# EAGLE design MultiColorLight (EAGLE 7.3.0)
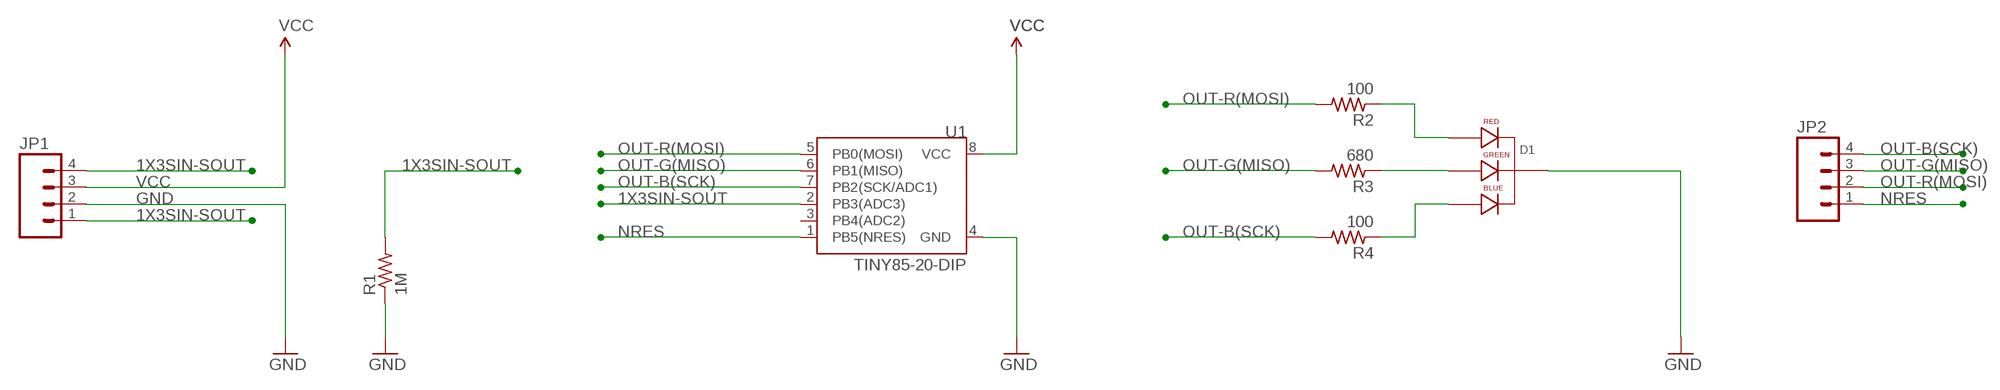
[diagram p0: schematic, sheet 1]

## Parts
D1  LED-RGB-CC-THRUCLEAR  [LED-RGB-THRU]
JP1  M04PTH  [1X04]
JP2  M04PTH  [1X04]
R1  1M  R-US_R0603  [R0603]
R2  100  R-US_R0603  [R0603]
R3  680  R-US_R0603  [R0603]
R4  100  R-US_R0603  [R0603]
U1  TINY85-20-DIP  ATTINY45TINY85-20-DIP  [DIP08]

## Nets
1X3SIN-SOUT: JP1.1 JP1.4 R1.2 U1.2(PB3(ADC3))
GND: D1.2(CATHODE) JP1.2 R1.1 U1.4(GND)
N$1: D1.1(RED_CATHODE) R2.1
N$2: D1.3(GREEN_CATHODE) R3.1
N$3: D1.4(BLUE_CATHODE) R4.1
NRES: JP2.1 U1.1(PB5(NRES))
OUT-B(SCK): JP2.4 R4.2 U1.7(PB2(SCK/ADC1))
OUT-G(MISO): JP2.3 R3.2 U1.6(PB1(MISO))
OUT-R(MOSI): JP2.2 R2.2 U1.5(PB0(MOSI))
VCC: JP1.3 U1.8(VCC)
Unconnected: U1.3(PB4(ADC2))

## Library data of the parts
D1 = SparkFun-LED:LED-RGB-CC-THRU: RGB Through-hole common cathode LED SparkFun Storefront: COM-00105 (Clear) COM-09264 (Diffuse); PROD_ID: DIO-08418
JP1 JP2 = SparkFun-Connectors:M04: Header 4 Standard 4-pin 0.1" header. Use with straight break away headers (SKU : PRT-00116), right angle break away headers (PRT-00553), swiss pins (PRT-00743), machine pins (PRT-00117), and female headers (PRT-00115). Molex polarized connector foot print use with SKU : PRT-08231 with associated crimp pins and housings. 1MM SMD Version SKU: PRT-10208
R1-R4 = adafruit:R-US_: RESISTOR, American symbol
U1 = SparkFun-DigitalIC:ATTINY45: Atmel 8-pin 2/4/8kB flash uC; PROD_ID: IC-09445

## Board
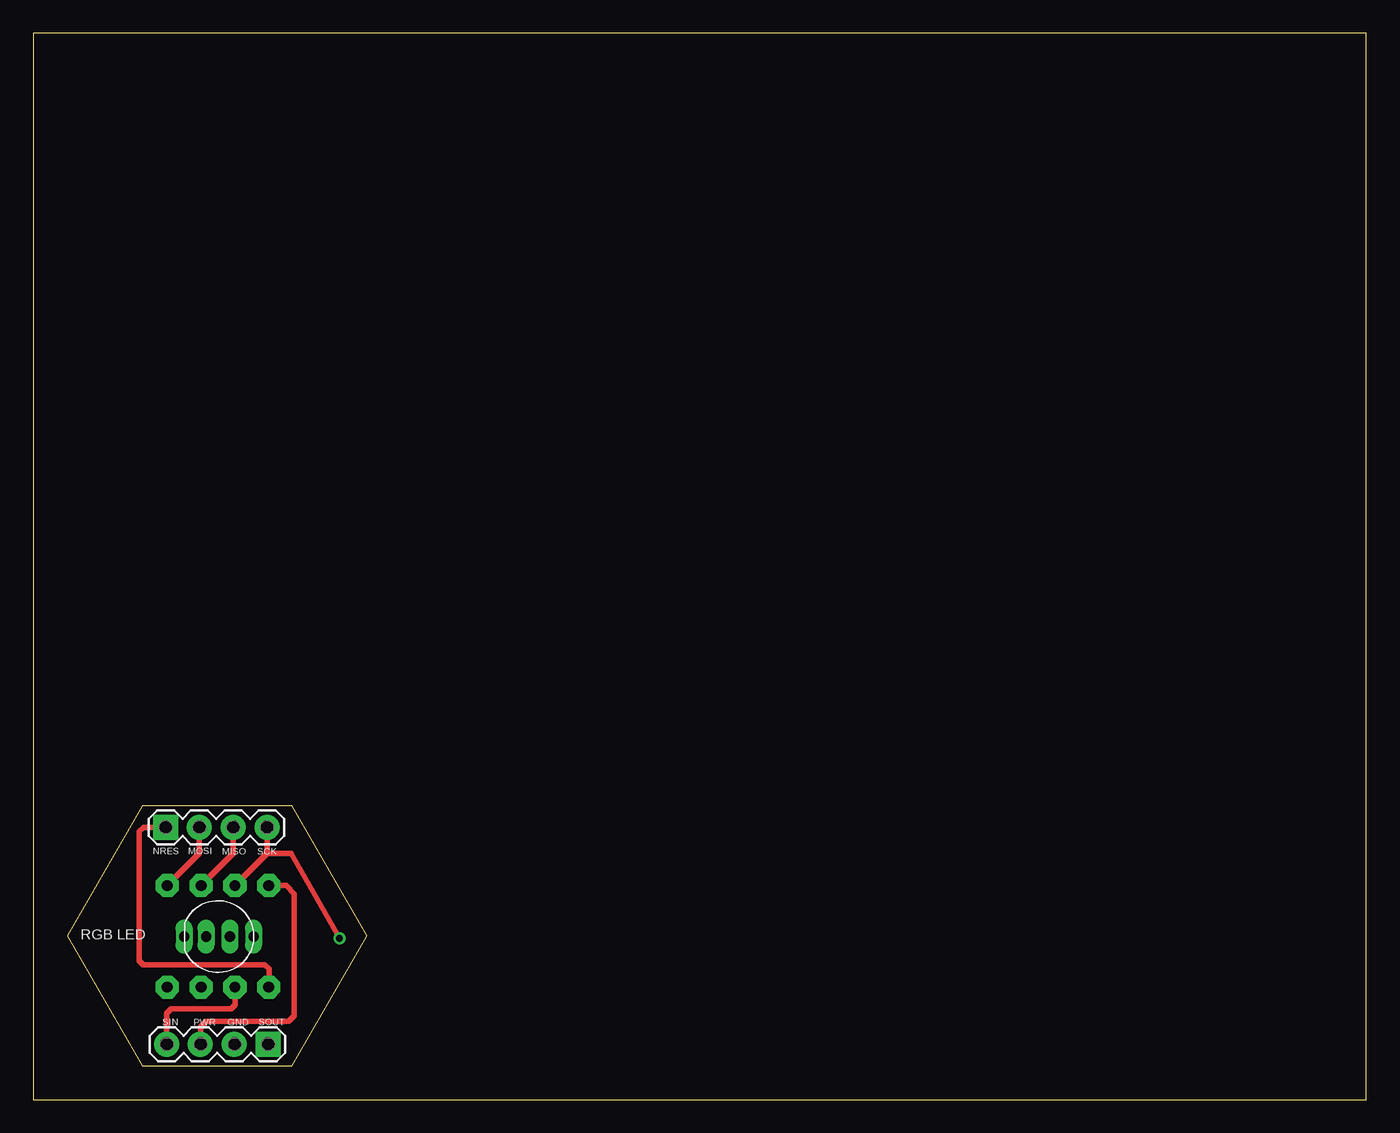
[diagram p1: board, top side]
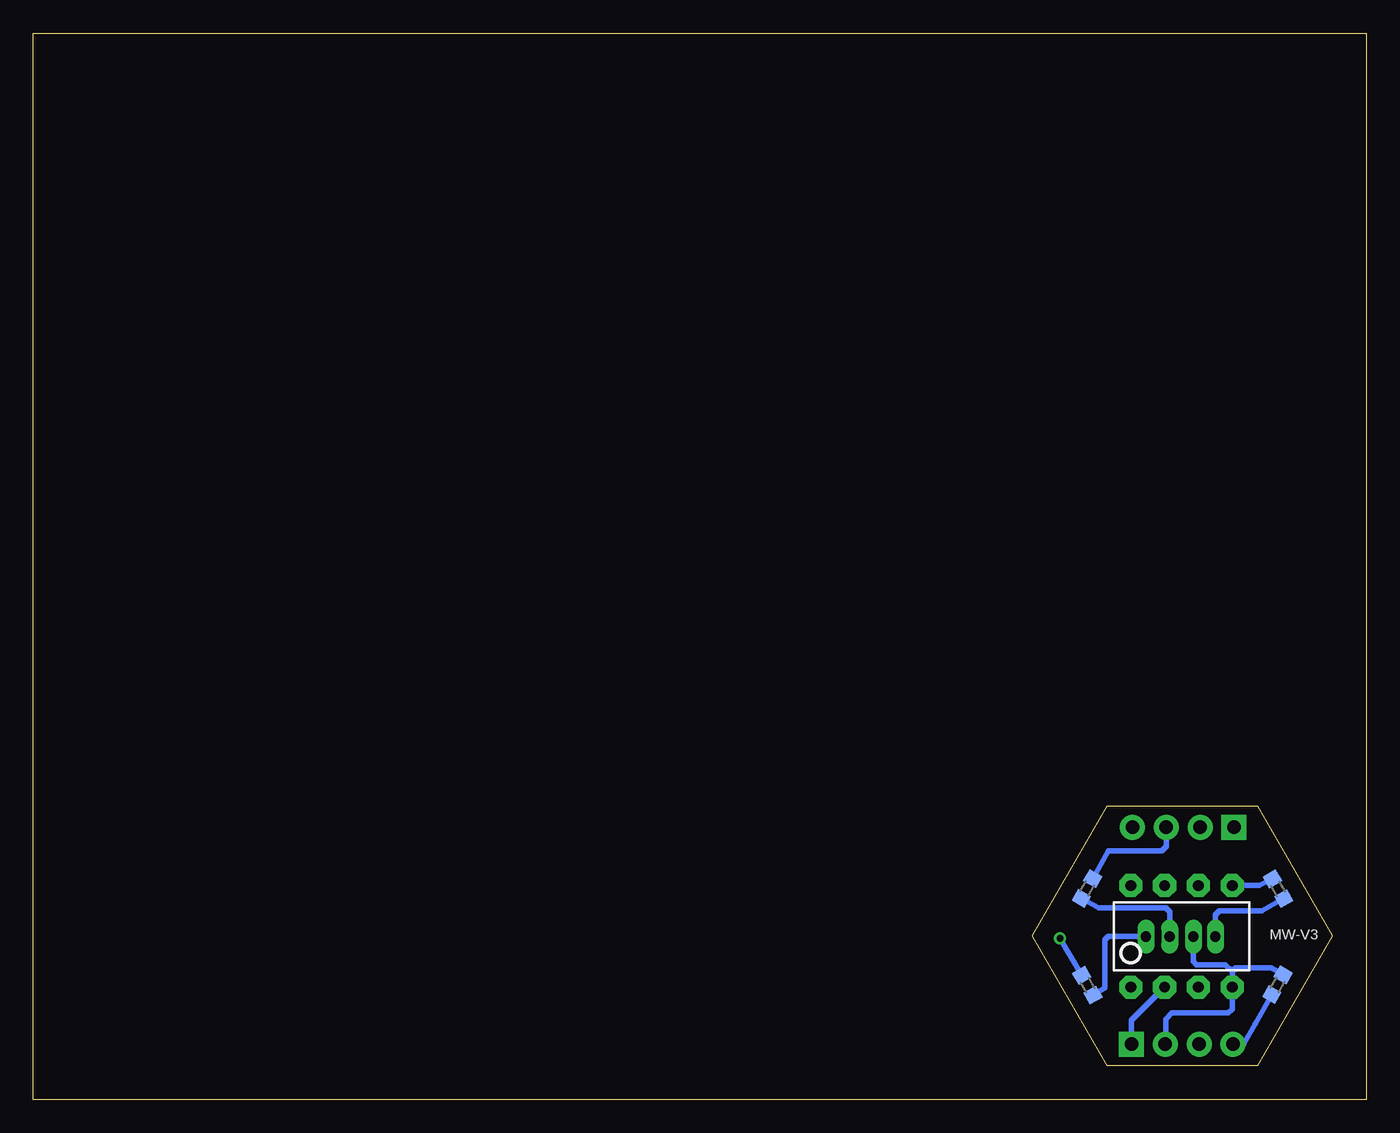
[diagram p2: board, bottom side, seen from below]

Size 100 x 80 mm. Coordinates in mm from the lower left corner, seen from the top.
Outline: 0,0 100,0 100,80 0,80 0,0
Outline: 8.16,2.55 19.41,2.55 25.03,12.29 19.41,22.03 8.16,22.03 2.53,12.29 8.16,2.55
Copper layers (1*16): Top 0.035mm / dielectric 1.5mm / Bottom 0.035mm
Design rules "default *": minimum track width 10mil, minimum drill 24mil, track to track 8mil, track to pad 8mil, pad to pad 8mil, via to via 8mil, smd to smd 8mil, copper to edge 0mil, drill to drill 8mil, minimum pad ring 10mil, minimum via ring 8mil, stop-mask expansion 4mil, vias tented up to drill 0mil, thermal gap 10mil

### Footprints (pad centres in the part's own frame; a part is rotated, then mirrored left to right if it is on the bottom)
LED-RGB-THRU = drill 0.762 pad 0.889 long: 1 2.54,0; 2 0.889,0; 3 -0.889,0; 4 -2.667,0
1X04 = drill 1.016 pad 1.88 square: 1 0,0 | drill 1.016 pad 1.88: 2 2.54,0; 3 5.08,0; 4 7.62,0
R0603 = smd 1 x 1.1: 1 -0.85,0; 2 0.85,0
DIP08 = drill 0.813 pad 1.727 octagon: 1 -3.81,-3.81; 2 -1.27,-3.81; 3 1.27,-3.81; 4 3.81,-3.81; 5 3.81,3.81; 6 1.27,3.81; 7 -1.27,3.81; 8 -3.81,3.81

### Placement (x,y rotation side)
D1  13.86,12.23 180 top
JP1  17.61,4.15 180 top
JP2  9.92,20.42 0 top
R1  6.65,8.61 240 bottom
R2  6.6,15.81 120 bottom
R3  20.94,15.84 60 bottom
R4  20.92,8.57 120 bottom
U1  13.86,12.24 0 bottom

### Tracks (layer width: path | path; a pad name or v marks a point on that pad's centre or on a via)
1X3SIN-SOUT
  Top 0.4: U1.2 15.13,7.1 14.83,6.81 10.34,6.81 10.01,6.48 10.01,4.17 JP1.4
  Bottom 0.4: R1.2 8.32,5.69 9.18,4.17 JP1.4 | JP1.1 17.61,5.94 U1.2
GND
  Bottom 0.4: R1.1 7.11,9.88 9.78,9.88 10.06,9.6 | 10.06,9.6 10.06,8.45 U1.4 10.05,6.77 10.32,6.49 14.59,6.49 15.05,6.03 15.05,4.18 JP1.2 | D1.2 12.97,10.36 12.72,10.12 10.58,10.12 10.06,9.6
N$1
  Bottom 0.4: R2.1 7.82,14.16 11.02,14.16 11.32,13.87 D1.1
N$2
  Bottom 0.4: D1.3 14.74,14.07 15.05,14.38 20.04,14.38 R3.1
N$3
  Bottom 0.4: D1.4 19.36,12.23 19.6,11.99 19.6,8.37 R4.1
NRES
  Top 0.4: JP2.1 8.27,20.42 7.95,20.1 7.95,10.39 8.23,10.11 17.36,10.11 17.68,9.79 17.68,8.45 U1.1
OUT-B(SCK)  (via drill 0.5)
  Top 0.4: JP2.4 17.54,18.47 | 17.54,18.47 U1.7 | v22.97,12.09 19.36,18.48 17.55,18.48 17.54,18.47
  Bottom 0.4: R4.2 v22.97,12.09
OUT-G(MISO)
  Top 0.4: JP2.3 15,18.47 U1.6
  Bottom 0.4: JP2.3 15,18.99 15.32,18.67 19.34,18.67 R3.2
OUT-R(MOSI)
  Top 0.4: JP2.2 12.46,18.47 U1.5
  Bottom 0.4: U1.5 8.03,16.05 R2.2
VCC
  Top 0.4: U1.8 18.96,16.05 19.58,15.43 19.58,6.29 19.16,5.87 12.97,5.87 12.55,5.45 12.55,4.17 JP1.3

### Text on the board
tPlace: NRES | MOSI | MISO | SCK | RGB LED | SIN | PWR | GND | SOUT
bPlace: MW-V3